# Altium schematic sheet ee453_pcb_yourname.SchDoc: EE 453 Capstone
size C; ApprovedBy: Your Name; CheckedBy: Your Name; Author: Your Name; CompanyName: Dept. of Elec. and Comp. Engg.; DrawnBy: Your Name; Engineer: Your Nmae; Organization: UW-Seattle; Address1: 185 Stevens Way; Address2: Paul Allen Center; Address3: Seattle, WA; Address4: US-98195; DocumentNumber: 1; Revision: 1.0; SheetNumber: 1; SheetTotal: 1
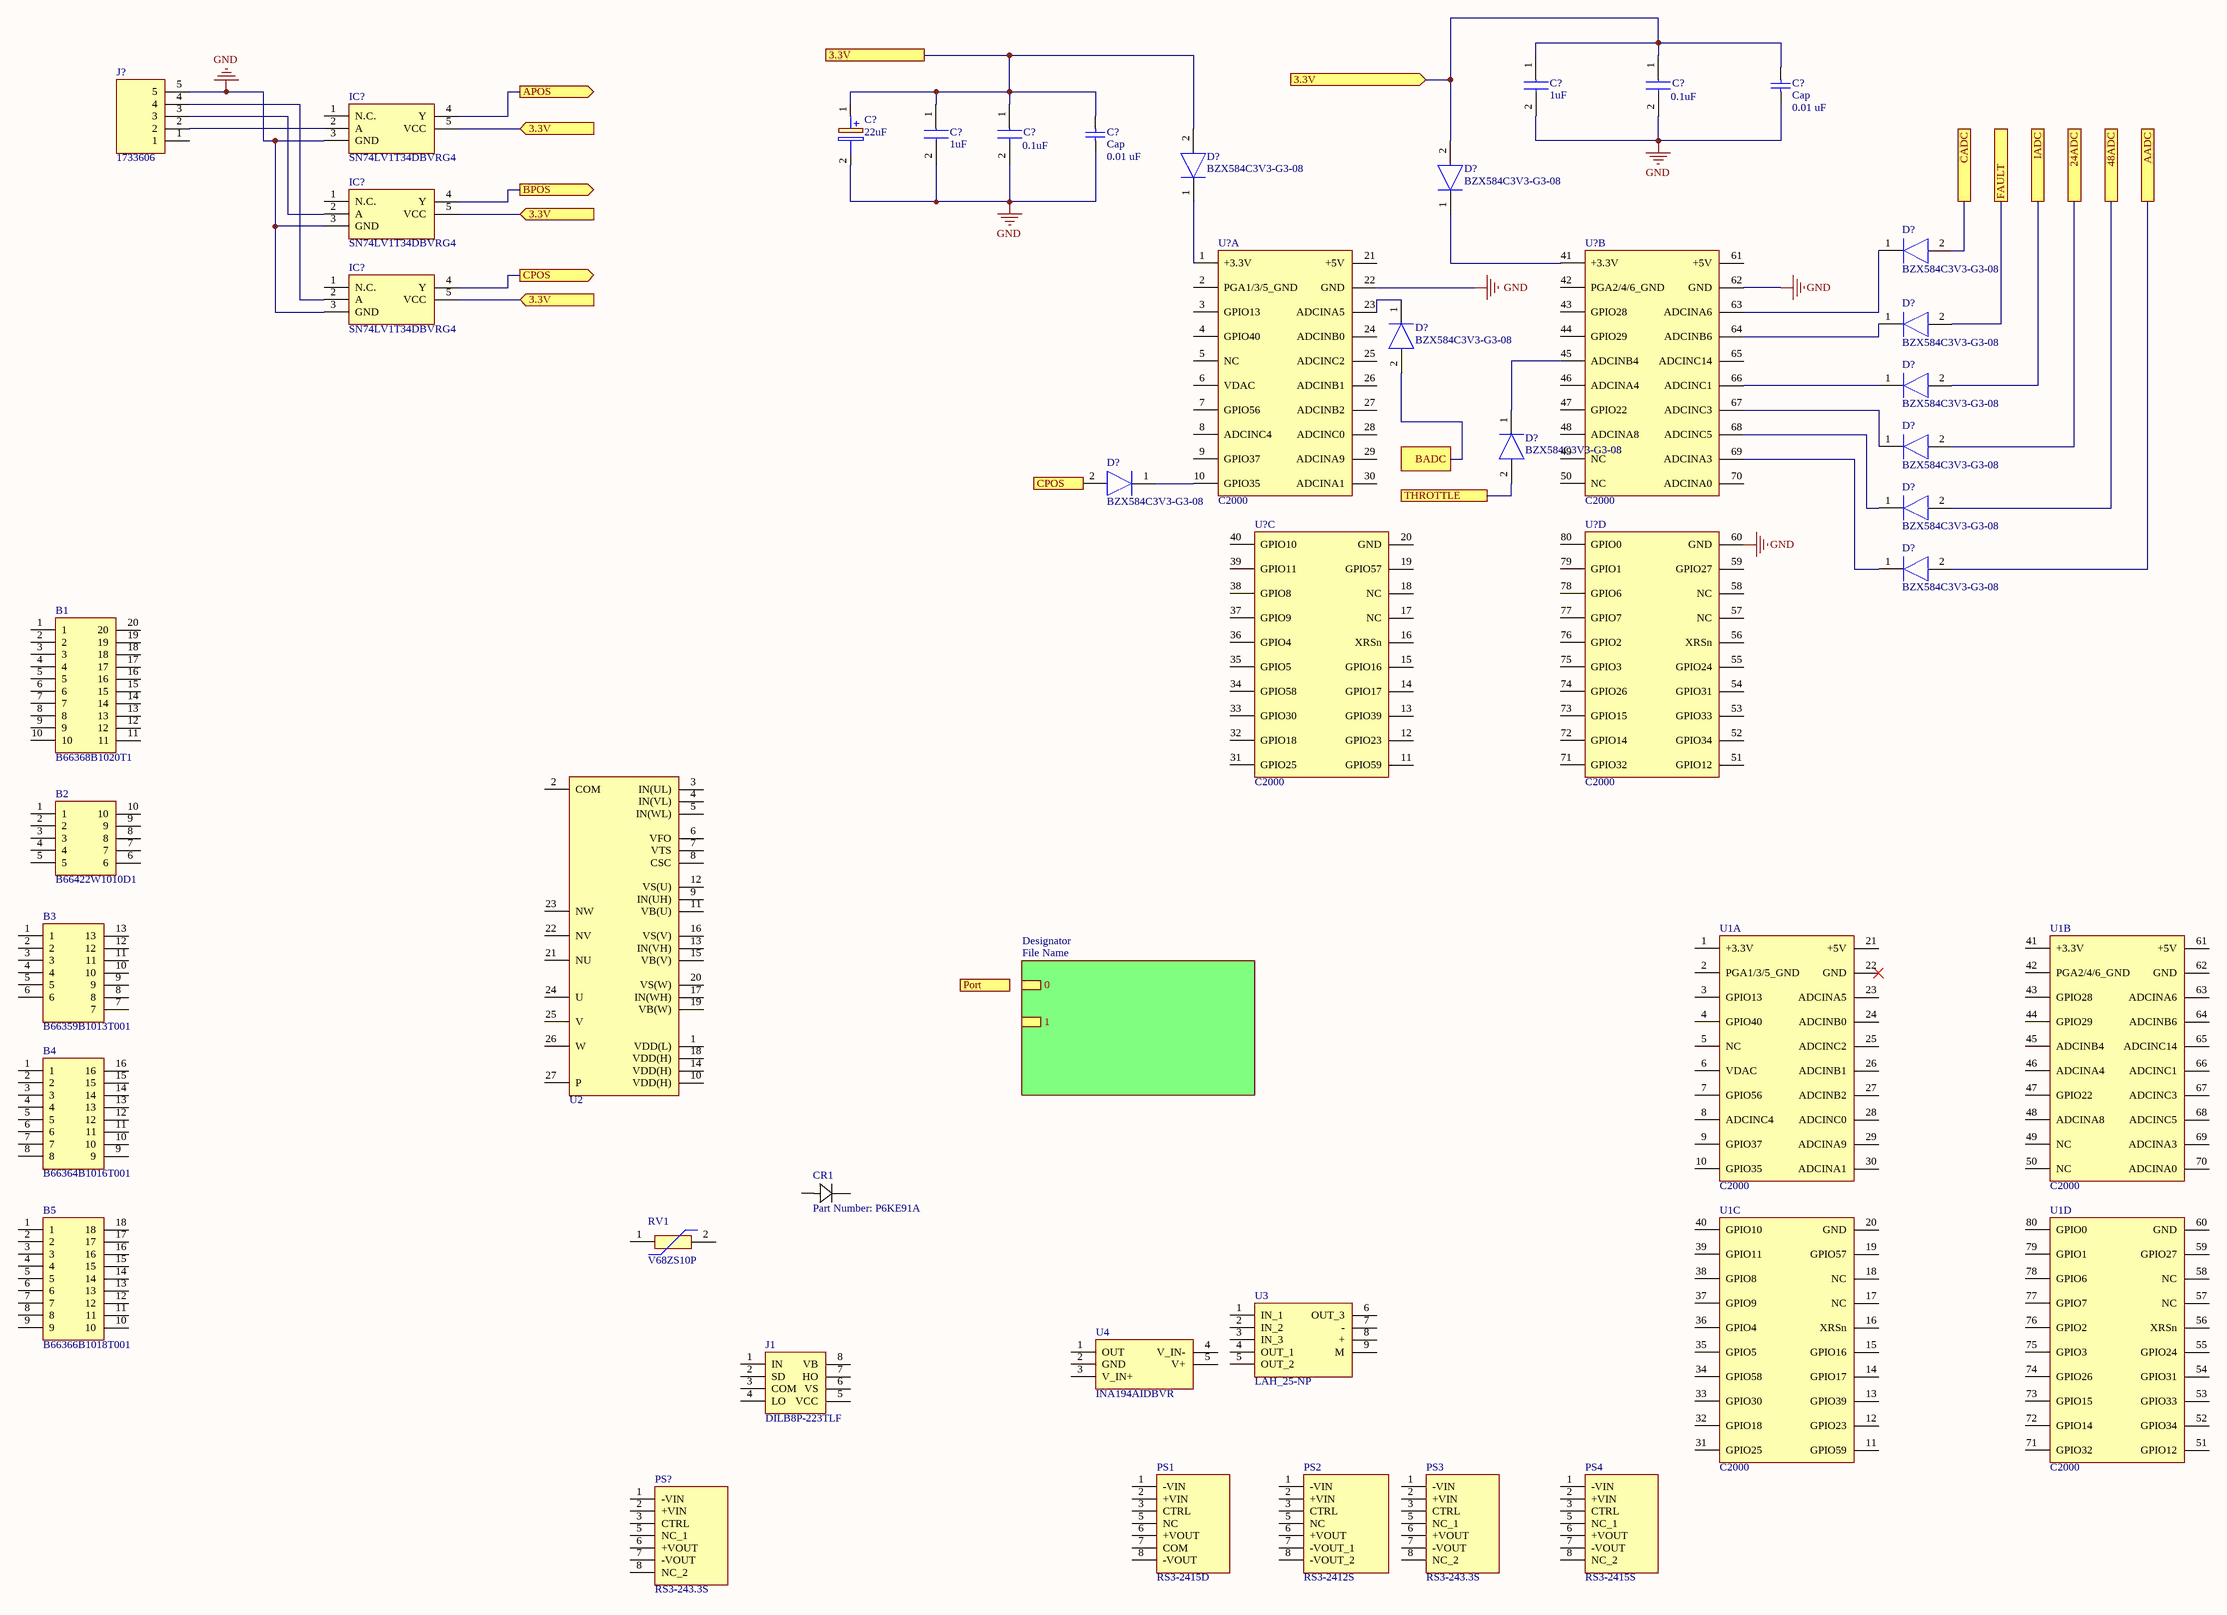
[diagram p0: ee453_pcb_yourname.SchDoc]

## Parts
(Parts that share a designator on the sheet are numbered #1, #2 ... from top to bottom, then left to right.)
B1  B66368B1020T1  [B66368B1020T1]
B2  B66422W1010D1  [B66422W1010D1]
B3  B66359B1013T001  [B66359B1013T001]
B4  B66364B1016T001  [B66364B1016T001]
B5  B66366B1018T001  [B66366B1018T001]
C?#1  1uF  [C330C105K5R5TA7303]
C?#2  0.1uF  [K104K10X7RF5UH5]
C?#3  Cap  value 0.01 uF  [RAD-0.3]
C?#4  22uF  [CAPPRD500W65D1000H2200]
C?#5  1uF  [C330C105K5R5TA7303]
C?#6  0.1uF  [K104K10X7RF5UH5]
C?#7  Cap  value 0.01 uF  [RAD-0.3]
CR1  Part Number: P6KE91A  [P6KESeries]
D?#1  BZX584C3V3-G3-08  [SODFL1608X75N]
D?#2  BZX584C3V3-G3-08  [SODFL1608X75N]
D?#3  BZX584C3V3-G3-08  [SODFL1608X75N]
D?#4  BZX584C3V3-G3-08  [SODFL1608X75N]
D?#5  BZX584C3V3-G3-08  [SODFL1608X75N]
D?#6  BZX584C3V3-G3-08  [SODFL1608X75N]
D?#7  BZX584C3V3-G3-08  [SODFL1608X75N]
D?#8  BZX584C3V3-G3-08  [SODFL1608X75N]
D?#9  BZX584C3V3-G3-08  [SODFL1608X75N]
D?#10  BZX584C3V3-G3-08  [SODFL1608X75N]
D?#11  BZX584C3V3-G3-08  [SODFL1608X75N]
IC?#1  SN74LV1T34DBVRG4  [SOT95P280X145-5N]
IC?#2  SN74LV1T34DBVRG4  [SOT95P280X145-5N]
IC?#3  SN74LV1T34DBVRG4  [SOT95P280X145-5N]
J1  DILB8P-223TLF  [DIPS762W60P254L1016H525Q8N]
J?  1733606  [1733606]
PS1  RS3-2415D  [RS32405DH3]
PS2  RS3-2412S  [RS32415S]
PS3  RS3-243.3S  [RS32433S]
PS4  RS3-2415S  [RS32415S]
PS?  RS3-243.3S  [RS32433S]
RV1  V68ZS10P  [V68ZS10P]
U1  C2000  [C2000]  (parts A,B,C,D of 4)
U2  FNB34060T  [FNB34060T]  (value not drawn)
U3  LAH_25-NP  [LAH-25-NP]
U4  INA194AIDBVR  [SOT95P280X145-5N]
U?#1  C2000  [C2000]  (part B of 4)
U?#2  C2000  [C2000]  (part A of 4)
U?#3  C2000  [C2000]  (part C of 4)
U?#4  C2000  [C2000]  (part D of 4)

## Sub-sheets
Designator = File Name: 0, 1

## Ports
3.3V, 3.3V (in), 24ADC, 48ADC, AADC, APOS (out), BADC, BPOS (out), CADC, CPOS, CPOS (out), FAULT, IADC, Port, THROTTLE

## Nets
 GND: C?#1.2 C?#2.2 C?#3.1 C?#4.2(-) C?#5.2 C?#6.2 C?#7.1 IC?#1.3(GND) IC?#2.3(GND) IC?#3.3(GND) J?.5 U?#1.62(GND) U?#2.22(GND) U?#4.60(GND)  [also labelled GND]
3.3V: C?#1.1 C?#2.1 C?#3.2 C?#4.1(+) C?#5.1 C?#6.1 C?#7.2 D?#1.2(A) D?#2.2(A) IC?#1.5(VCC) IC?#2.5(VCC) IC?#3.5(VCC) ; port 3.3V
24ADC: D?#8.2(A) ; port 24ADC
48ADC: D?#10.2(A) ; port 48ADC
AADC: D?#11.2(A) ; port AADC
APOS: IC?#1.4(Y) ; port APOS
BADC: D?#4.2(A) ; port BADC
BPOS: IC?#2.4(Y) ; port BPOS
CADC: D?#3.2(A) ; port CADC
CPOS: D?#9.2(A) IC?#3.4(Y) ; port CPOS
FAULT: D?#5.2(A) ; port FAULT
IADC: D?#6.2(A) ; port IADC
THROTTLE: D?#7.2(A) ; port THROTTLE
NetD?#1_1: D?#1.1(K) U?#2.1(+3.3V)
NetD?#2_1: D?#2.1(K) U?#1.41(+3.3V)
NetD?#3_1: D?#3.1(K) U?#1.63(ADCINA6)
NetD?#4_1: D?#4.1(K) U?#2.23(ADCINA5)
NetD?#5_1: D?#5.1(K) U?#1.64(ADCINB6)
NetD?#6_1: D?#6.1(K) U?#1.66(ADCINC1)
NetD?#7_1: D?#7.1(K) U?#1.45(ADCINB4)
NetD?#8_1: D?#8.1(K) U?#1.67(ADCINC3)
NetD?#9_1: D?#9.1(K) U?#2.10(GPIO35)
NetD?#10_1: D?#10.1(K) U?#1.68(ADCINC5)
NetD?#11_1: D?#11.1(K) U?#1.69(ADCINA3)
NetIC?#1_2: IC?#1.2(A) J?.2
NetIC?#2_2: IC?#2.2(A) J?.3
NetIC?#3_2: IC?#3.2(A) J?.4

Not connected (* = marked no-connect by the designer): B1 1 2 3 4 5 6 7 8 9 10 11 12 13 14 15 16 17 18 19 20; B2 1 2 3 4 5 6 7 8 9 10; B3 1 2 3 4 5 6 7 8 9 10 11 12 13; B4 1 2 3 4 5 6 7 8 9 10 11 12 13 14 15 16; B5 1 2 3 4 5 6 7 8 9 10 11 12 13 14 15 16 17 18; CR1 1 2; IC?#1 1(N.C.); IC?#2 1(N.C.); IC?#3 1(N.C.); J1 1(IN) 2(SD) 3(COM) 4(LO) 5(VCC) 6(VS) 7(HO) 8(VB); J? 1; PS1 1(-VIN) 2(+VIN) 3(CTRL) 5(NC) 6(+VOUT) 7(COM) 8(-VOUT); PS2 1(-VIN) 2(+VIN) 3(CTRL) 5(NC) 6(+VOUT) 7(-VOUT_1) 8(-VOUT_2); PS3 1(-VIN) 2(+VIN) 3(CTRL) 5(NC_1) 6(+VOUT) 7(-VOUT) 8(NC_2); PS4 1(-VIN) 2(+VIN) 3(CTRL) 5(NC_1) 6(+VOUT) 7(-VOUT) 8(NC_2); PS? 1(-VIN) 2(+VIN) 3(CTRL) 5(NC_1) 6(+VOUT) 7(-VOUT) 8(NC_2); RV1 1 2; U1 1(+3.3V) 2(PGA1/3/5_GND) 3(GPIO13) 4(GPIO40) 5(NC) 6(VDAC) 7(GPIO56) 8(ADCINC4) 9(GPIO37) 10(GPIO35) 11(GPIO59) 12(GPIO23) 13(GPIO39) 14(GPIO17) 15(GPIO16) 16(XRSn) 17(NC) 18(NC) 19(GPIO57) 20(GND) 21(+5V) 22(GND)* 23(ADCINA5) 24(ADCINB0) 25(ADCINC2) 26(ADCINB1) 27(ADCINB2) 28(ADCINC0) 29(ADCINA9) 30(ADCINA1) 31(GPIO25) 32(GPIO18) 33(GPIO30) 34(GPIO58) 35(GPIO5) 36(GPIO4) 37(GPIO9) 38(GPIO8) 39(GPIO11) 40(GPIO10) 41(+3.3V) 42(PGA2/4/6_GND) 43(GPIO28) 44(GPIO29) 45(ADCINB4) 46(ADCINA4) 47(GPIO22) 48(ADCINA8) 49(NC) 50(NC) 51(GPIO12) 52(GPIO34) 53(GPIO33) 54(GPIO31) 55(GPIO24) 56(XRSn) 57(NC) 58(NC) 59(GPIO27) 60(GND) 61(+5V) 62(GND) 63(ADCINA6) 64(ADCINB6) 65(ADCINC14) 66(ADCINC1) 67(ADCINC3) 68(ADCINC5) 69(ADCINA3) 70(ADCINA0) 71(GPIO32) 72(GPIO14) 73(GPIO15) 74(GPIO26) 75(GPIO3) 76(GPIO2) 77(GPIO7) 78(GPIO6) 79(GPIO1) 80(GPIO0); U2 1(VDD(L)) 2(COM) 3(IN(UL)) 4(IN(VL)) 5(IN(WL)) 6(VFO) 7(VTS) 8(CSC) 9(IN(UH)) 10(VDD(H)) 11(VB(U)) 12(VS(U)) 13(IN(VH)) 14(VDD(H)) 15(VB(V)) 16(VS(V)) 17(IN(WH)) 18(VDD(H)) 19(VB(W)) 20(VS(W)) 21(NU) 22(NV) 23(NW) 24(U) 25(V) 26(W) 27(P); U3 1(IN_1) 2(IN_2) 3(IN_3) 4(OUT_1) 5(OUT_2) 6(OUT_3) 7(-) 8(+) 9(M); U4 1(OUT) 2(GND) 3(V_IN+) 4(V_IN-) 5(V+); U?#1 42(PGA2/4/6_GND) 43(GPIO28) 44(GPIO29) 46(ADCINA4) 47(GPIO22) 48(ADCINA8) 49(NC) 50(NC) 61(+5V) 65(ADCINC14) 70(ADCINA0); U?#2 2(PGA1/3/5_GND) 3(GPIO13) 4(GPIO40) 5(NC) 6(VDAC) 7(GPIO56) 8(ADCINC4) 9(GPIO37) 21(+5V) 24(ADCINB0) 25(ADCINC2) 26(ADCINB1) 27(ADCINB2) 28(ADCINC0) 29(ADCINA9) 30(ADCINA1); U?#3 11(GPIO59) 12(GPIO23) 13(GPIO39) 14(GPIO17) 15(GPIO16) 16(XRSn) 17(NC) 18(NC) 19(GPIO57) 20(GND) 31(GPIO25) 32(GPIO18) 33(GPIO30) 34(GPIO58) 35(GPIO5) 36(GPIO4) 37(GPIO9) 38(GPIO8) 39(GPIO11) 40(GPIO10); U?#4 51(GPIO12) 52(GPIO34) 53(GPIO33) 54(GPIO31) 55(GPIO24) 56(XRSn) 57(NC) 58(NC) 59(GPIO27) 71(GPIO32) 72(GPIO14) 73(GPIO15) 74(GPIO26) 75(GPIO3) 76(GPIO2) 77(GPIO7) 78(GPIO6) 79(GPIO1) 80(GPIO0)

## Notes on the sheet
- Title
- Size:
- Date:
- File:
- C
- Number:
- Time:
- Revision:
- Sheet
- of

## Library data of the parts
B1 = B66368B1020T1: Bobbin; Manufacturer_Name: EPCOS; Datasheet Link: https://componentsearchengine.com/Datasheets/1/B66368B1020T1.pdf; Height: 40.9mm; Mouser2 Part Number: 871-B66368B1020T1; Mouser2 Price/Stock: https://www.mouser.com/Search/Refine.aspx?Keyword=871-B66368B1020T1; Manufacturer_Part_Number: B66368B1020T1
B2 = B66422W1010D1: Bobbin; Manufacturer_Name: EPCOS; Datasheet Link: https://componentsearchengine.com/Datasheets/1/B66422W1010D1.pdf; Height: 12mm; Mouser2 Part Number: 871-B66422W1010D1; Mouser2 Price/Stock: https://www.mouser.com/Search/Refine.aspx?Keyword=871-B66422W1010D1; Manufacturer_Part_Number: B66422W1010D1
B3 = B66359B1013T001: Bobbin; Manufacturer_Name: EPCOS; Datasheet Link: https://componentsearchengine.com/Datasheets/1/B66359B1013T001.pdf; Height: 25mm; Mouser2 Part Number: 871-B66359B1013T001; Mouser2 Price/Stock: https://www.mouser.com/Search/Refine.aspx?Keyword=871-B66359B1013T001; Manufacturer_Part_Number: B66359B1013T001
B4 = B66364B1016T001: Bobbin; Manufacturer_Name: EPCOS; Datasheet Link: https://componentsearchengine.com/Datasheets/1/B66364B1016T001.pdf; Height: 35.5mm; Mouser2 Part Number: 871-B66364B1016T001; Mouser2 Price/Stock: https://www.mouser.com/Search/Refine.aspx?Keyword=871-B66364B1016T001; Manufacturer_Part_Number: B66364B1016T001
B5 = B66366B1018T001: Bobbin; Manufacturer_Name: EPCOS; Datasheet Link: http://uk.rs-online.com/web/p/products/1620179; Height: 38.4mm; Manufacturer_Part_Number: B66366B1018T001; RS Part Number: 1620179; RS Price/Stock: http://uk.rs-online.com/web/p/products/1620179
C?#1 C?#5 = C330C105K5R5TA7303: Capacitor; Manufacturer_Name: Kemet; Datasheet Link: https://content.kemet.com/datasheets/KEM_C1050_GOLDMAX_X7R.pdf; Height: 10.66mm; Manufacturer_Part_Number: C330C105K5R5TA7303; Mouser Part Number: 80-C330C105K5R-TR; Mouser Price/Stock: https://www.mouser.com/Search/Refine.aspx?Keyword=80-C330C105K5R-TR; Arrow Part Number: C330C105K5R5TA7303; Arrow Price/Stock: https://www.arrow.com/en/products/c330c105k5r5ta7303/kemet-corporation
C?#2 C?#6 = K104K10X7RF5UH5: Capacitor; Manufacturer_Name: Vishay; Datasheet Link: https://www.vishay.com/docs/45171/kseries.pdf; Height: 6.2mm; Manufacturer_Part_Number: K104K10X7RF5UH5; Mouser Part Number: 594-K104K10X7RF5UH5; Mouser Price/Stock: https://www.mouser.co.uk/ProductDetail/Vishay-BC-Components/K104K10X7RF5UH5?qs=rLgk8CAOBHbAqIwDswVbzA%3D%3D; Arrow Part Number: K104K10X7RF5UH5; Arrow Price/Stock: https://www.arrow.com/en/products/k104k10x7rf5uh5/vishay
C?#3 C?#7 = Cap: Capacitor; Published: 8-Jun-2000; LatestRevisionDate: 17-Jul-2002; LatestRevisionNote: Re-released for DXP Platform.; PackageReference: RAD-0.3; Publisher: Altium Limited; PackageDescription: Radial Cap, Thru-Hole; 2 Leads; 0.3 in Pin Spacing
C?#4 = EEU-ED2E220: Capacitor Polarised; Manufacturer_Name: Panasonic; Datasheet Link: https://industrial.panasonic.com/cdbs/www-data/pdf/RDF0000/ABA0000C1258.pdf; Height: 22mm; Manufacturer_Part_Number: EEU-ED2E220
CR1 = P6KE91A: No Description Available; Vendor: Littelfuse Inc; Built_By: EMA_UL_Team; Type: DEV; Manufacturer_Part_Number: P6KE91A; Copyright: Copyright (C) 2018 Accelerated Designs. All rights reserved; RefDes: RefDes; Value: Value
D?#1-D?#11 = BZX584C3V3-G3-08: Diode; Manufacturer_Name: Vishay; Datasheet Link: https://componentsearchengine.com/Datasheets/1/BZX584C3V3-G3-08.pdf; Height: 0.75mm; Manufacturer_Part_Number: BZX584C3V3-G3-08; Mouser Part Number: 78-BZX584C3V3-G3-08; Mouser Price/Stock: https://www.mouser.co.uk/ProductDetail/Vishay-Semiconductors/BZX584C3V3-G3-08?qs=OTrKUuiFdkYVBI02zFffJQ%3D%3D
IC?#1-IC?#3 = SN74LV1T34DBVRG4: Integrated Circuit; Manufacturer_Name: Texas Instruments; Datasheet Link: http://www.ti.com/lit/gpn/sn74lv1t34; Height: 1.45mm; Manufacturer_Part_Number: SN74LV1T34DBVRG4; Mouser Part Number: 595-SN74LV1T34DBVRG4; Mouser Price/Stock: https://www.mouser.co.uk/ProductDetail/Texas-Instruments/SN74LV1T34DBVRG4?qs=vdi0iO8H4N10R%252Bt%252BjmxZrg%3D%3D; Arrow Part Number: SN74LV1T34DBVRG4; Arrow Price/Stock: https://www.arrow.com/en/products/sn74lv1t34dbvrg4/texas-instruments
J1 = DILB8P-223TLF: Connector; Manufacturer_Name: Amphenol; Datasheet Link: https://componentsearchengine.com/Datasheets/1/DILB8P-223TLF.pdf; Height: 5.25mm; Mouser2 Part Number: 649-DILB8P223TLF; Mouser2 Price/Stock: https://www.mouser.com/Search/Refine.aspx?Keyword=649-DILB8P223TLF; Manufacturer_Part_Number: DILB8P-223TLF
J? = 1733606: Connector; Manufacturer_Name: Phoenix Contact; Datasheet Link: https://www.phoenixcontact.com/online/portal/us?uri=pxc-oc-itemdetail:pid=1733606&library=usen&tab=1; Height: 15.45mm; Manufacturer_Part_Number: 1733606; Mouser Part Number: 651-1733606; Mouser Price/Stock: https://www.mouser.co.uk/ProductDetail/Phoenix-Contact/1733606/?qs=coeDwHeOZKnxpzvXWWKBZQ%3D%3D; Arrow Part Number: 1733606; Arrow Price/Stock: https://www.arrow.com/en/products/1733606/phoenix-contact
PS1 = RS3-2415D: Power Supply; Manufacturer_Name: RECOM Power; Allied_Number: 70052275; Datasheet Link: https://www.recom-power.com/pdf/Econoline/RS3-S_D_Z.pdf; Height: 11.35mm; Manufacturer_Part_Number: RS3-2415D; Mouser Part Number: 919-RS3-2415D; Mouser Price/Stock: https://www.mouser.com/Search/Refine.aspx?Keyword=919-RS3-2415D; RS Part Number: 1669089; RS Price/Stock: https://uk.rs-online.com/web/p/products/1669089; Allied Price/Stock: https://www.alliedelec.com/recom-power-inc-rs3-2415d/70052275/
PS2 = RS3-2412S: 24/12V Power Supply; Manufacturer_Name: RECOM Power; Datasheet Link: https://www.recom-power.com/pdf/Econoline/RS3-S_D_Z.pdf; Manufacturer_Part_Number: RS3-2412S; Mouser Part Number: 919-RS3-2412S; Mouser Price/Stock: https://www.mouser.com/Search/Refine.aspx?Keyword=919-RS3-2412S; RS Part Number: 1669097; RS Price/Stock: https://uk.rs-online.com/web/p/products/1669097
PS3 = RS3-243.3S: 24/3.3V Power Supply; Manufacturer_Name: RECOM Power; Datasheet Link: https://www.arrow.com/en/products/rs3-243.3s/recom-power; Height: 11.35mm; Manufacturer_Part_Number: RS3-243.3S; Mouser Part Number: 919-RS3-243.3S; Mouser Price/Stock: https://www.mouser.com/Search/Refine.aspx?Keyword=919-RS3-243.3S; RS Part Number: 0163748P; RS Price/Stock: http://uk.rs-online.com/web/p/products/0163748P
PS4 = RS3-2415S: 24/15V Power Supply; Manufacturer_Name: RECOM Power; Datasheet Link: https://www.recom-power.com/pdf/Econoline/RS3-S_D_Z.pdf; Height: 11.35mm; Manufacturer_Part_Number: RS3-2415S; Mouser Part Number: 919-RS3-2415S; Mouser Price/Stock: https://www.mouser.com/Search/Refine.aspx?Keyword=919-RS3-2415S
PS? = RS3-243.3S: Power Supply; Manufacturer_Name: RECOM Power; Datasheet Link: https://www.arrow.com/en/products/rs3-243.3s/recom-power; Height: 11.35mm; Manufacturer_Part_Number: RS3-243.3S; Mouser Part Number: 919-RS3-243.3S; Mouser Price/Stock: https://www.mouser.com/Search/Refine.aspx?Keyword=919-RS3-243.3S; Arrow Part Number: RS3-243.3S; Arrow Price/Stock: https://www.arrow.com/en/products/rs3-243.3s/recom-power
RV1 = V68ZS10P: Varistor; Manufacturer_Name: LITTELFUSE; Datasheet Link: http://www.littelfuse.com/~/media/electronics/datasheets/varistors/littelfuse_varistor_za_datasheet.pdf.pdf; Height: 20mm; Manufacturer_Part_Number: V68ZS10P
U1 U?#1-U?#4 = C2000: F280049C; Parameter 1: test 2
U3 = LAH_25-NP: Integrated Circuit; Manufacturer_Name: LEM; Manufacturer_Part_Number: LAH 25-NP; Datasheet Link: http://www.lem.com/docs/products/lah_25-np.pdf
U4 = INA194AIDBVR: Integrated Circuit; Manufacturer_Name: Texas Instruments; Datasheet Link: http://www.ti.com/lit/gpn/ina194; Height: 1.45mm; Manufacturer_Part_Number: INA194AIDBVR